# Altium schematic sheet DS33.SchDoc: Плата датчика глубины
size 594 x 420 mm; Author: Стороженко; DrawnBy: Сторож; DocumentNumber: ИПМТ.916197.001 Э3; SheetNumber: 1; SheetTotal: 1; DocumentType1str: Схема; PageSetup: Record=PageOptions|CenterHorizontal=True|CenterVertical=True|PrintScale=0.47|XCorrection=1.00|YCorrection=1.00|PrintKind=1|BorderSize=5000000|LeftOffset=0|BottomOffset=0|Orientation=1|PaperLength=2970|PaperWidth=2100|Scale=100|PaperSource=7|PrintQuality=600|MediaType=0|DitherType=10|PaperKind=A4|PrintScaleMode=1; DocumentName: Кафедра; ModifiedDate: Кафедра; Rule: PcbType=ProtelPcb
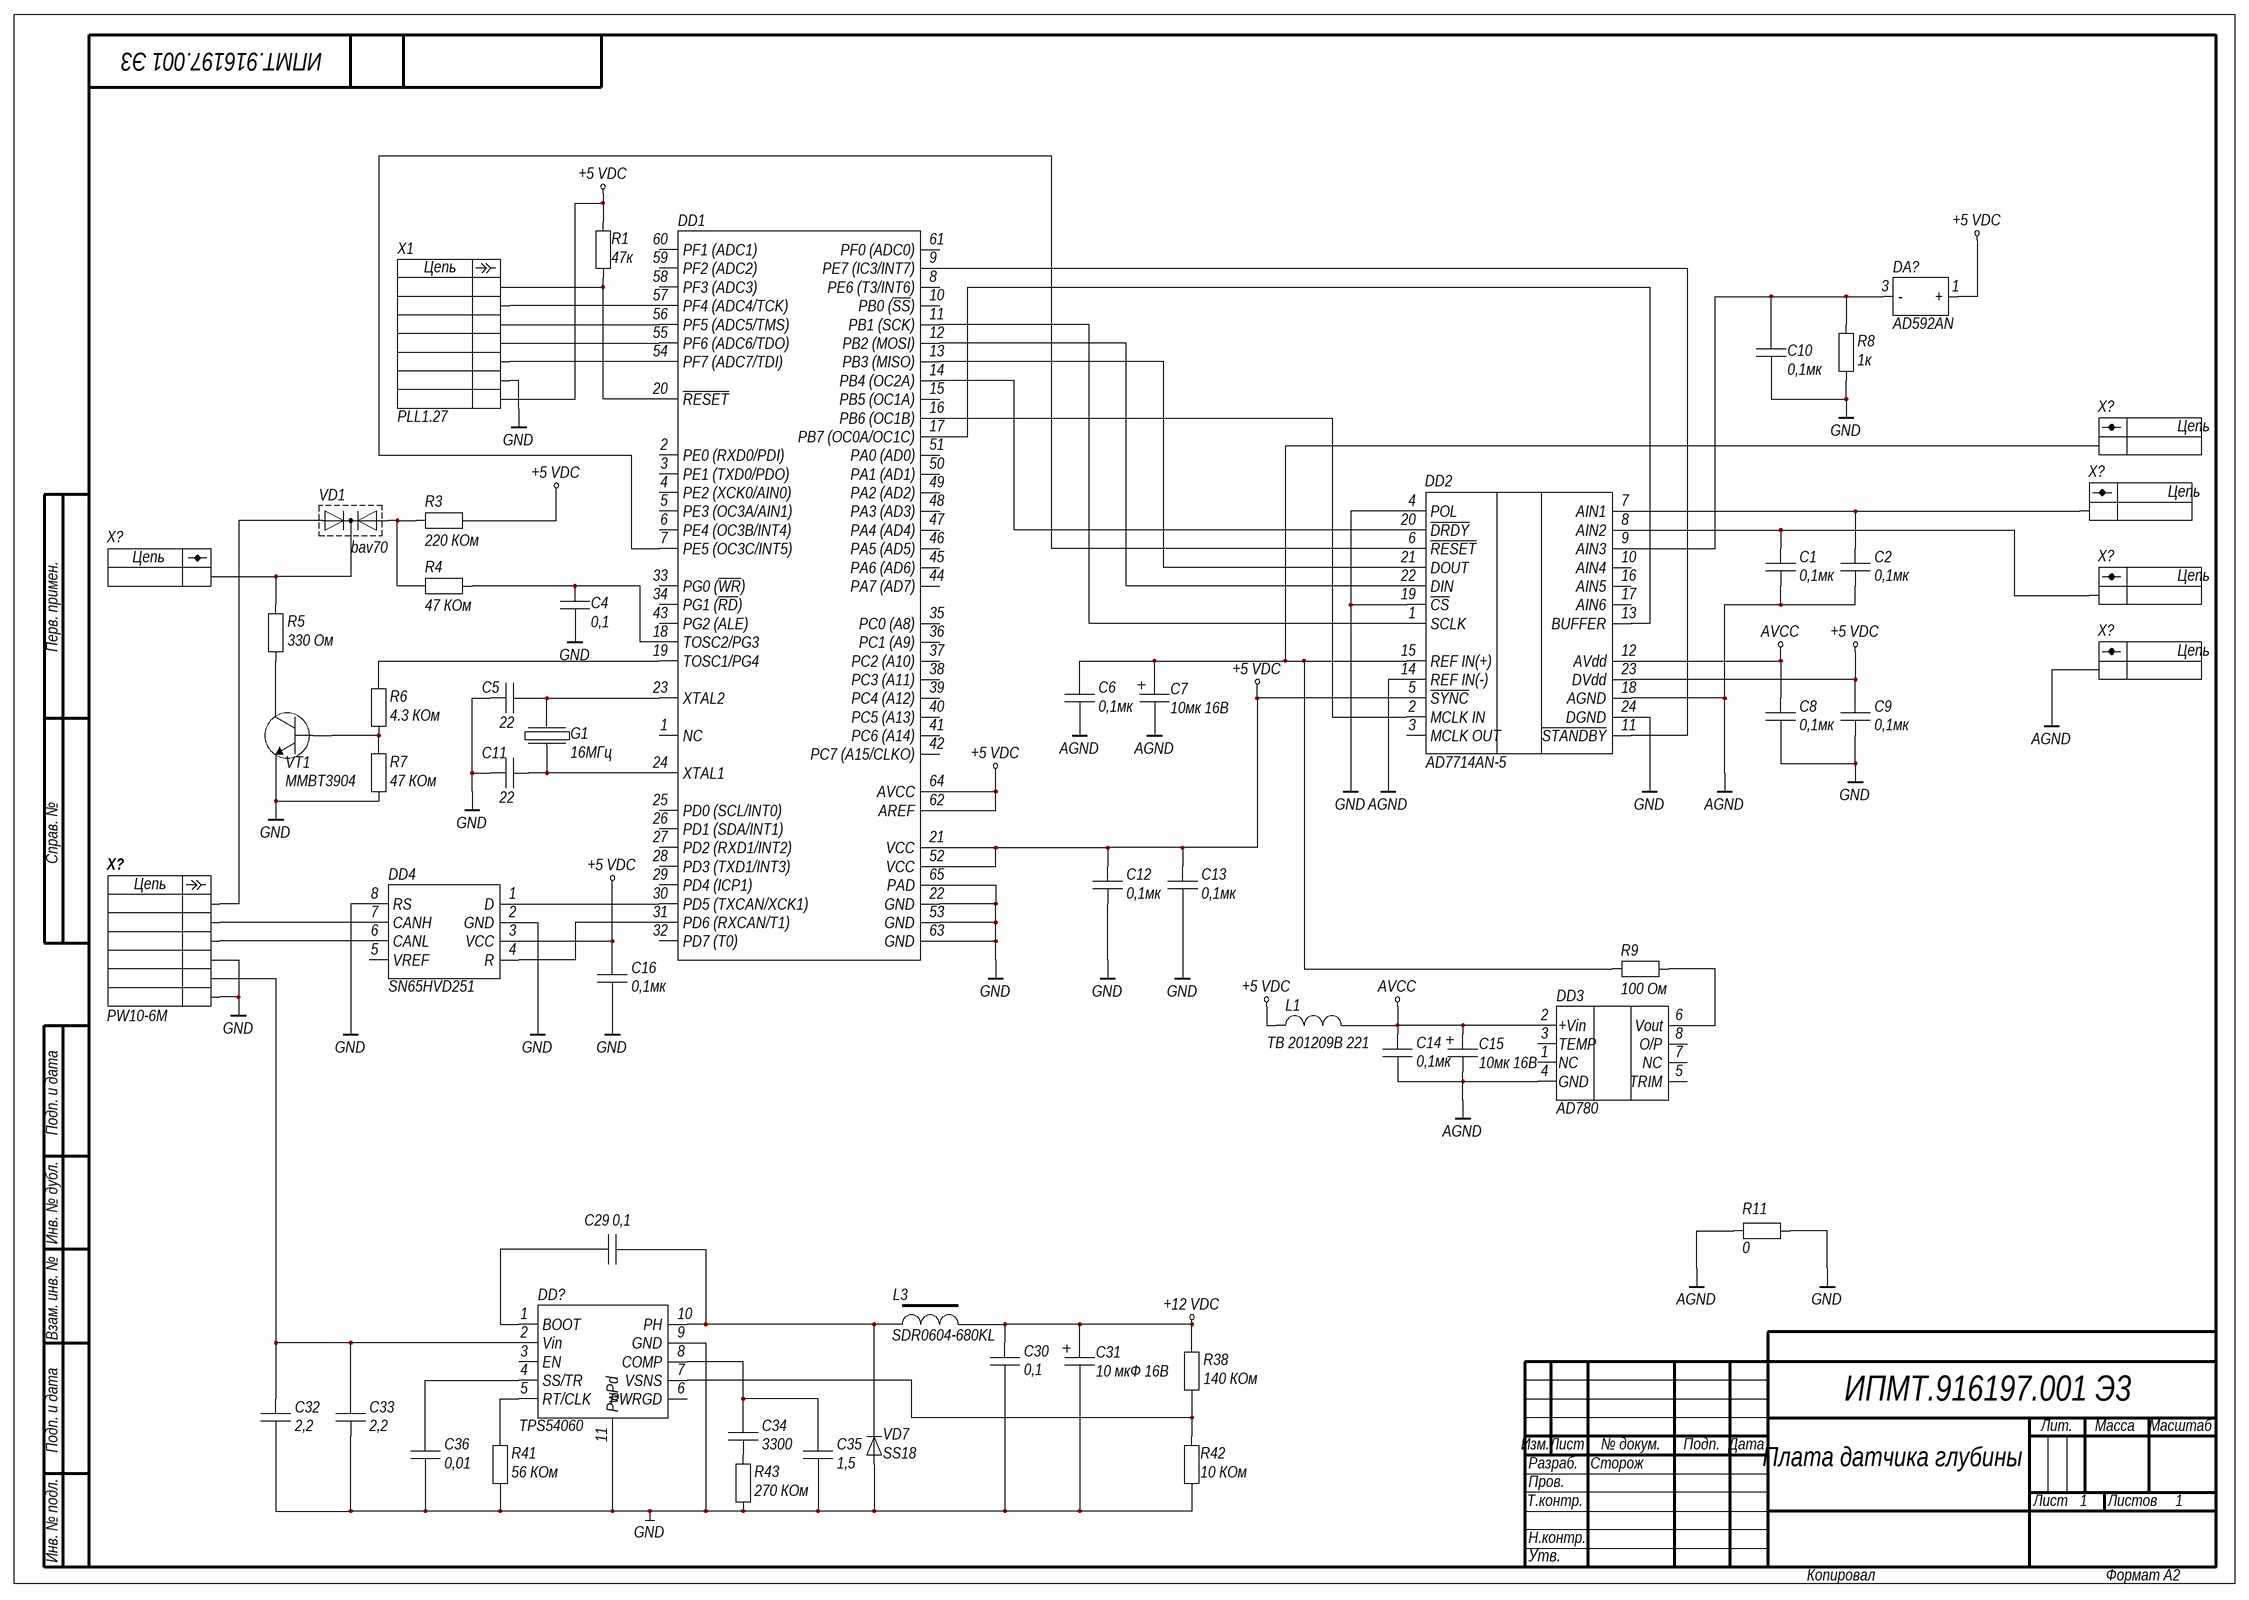
[diagram p0: DS33.SchDoc]

## Parts
(Parts that share a designator on the sheet are numbered #1, #2 ... from top to bottom, then left to right.)
C1  0,1мк  [0402]
C2  0,1мк  [0402]
C4  0,1  [0402]
C5  22  [0402]
C6  0,1мк  [0402]
C7  10мк 16В  [TC3216-1206]
C8  0,1мк  [0402]
C9  0,1мк  [0402]
C10  0,1мк  [0402]
C11  22  [0402]
C12  0,1мк  [0402]
C13  0,1мк  [0402]
C14  0,1мк  [0402]
C15  10мк 16В  [TC3216-1206]
C16  0,1мк  [0402]
C29  0,1  [0402]
C30  0,1  [С0603]
C31  10 мкФ 16В  [TC3216-1206]
C32  2,2  [1206]
C33  2,2  [1206]
C34  3300  [0402]
C35  1,5  [0402]
C36  0,01  [0402]
DA?  AD592AN  [TO-92]
DD1  (no value)  [QFN50P900X900-64V3L]
DD2  AD7714AN-5  [AD7714_TSOP65P640X110-24N]
DD3  AD780  [AD780_SOIC127P600X135-8N]
DD4  SN65HVD251  [SOJ-8]
DD?  TPS54060  [TSSOP50P490_HS-10L]
G1  16МГц  [KX-8]
L1  TB 201209B 221  [L0805]
L3  SDR0604-680KL  [CDRH5D28-100NC]
R1  47к  [0402]
R3  220 КОм  [0402]
R4  47 КОм  [0402]
R5  330 Ом  [0402]
R6  4.3 КОм  [0402]
R7  47 КОм  [0402]
R8  1к  [0402]
R9  100 Ом  [0603]
R11  0  [0402]
R38  140 КОм  [0402]
R41  56 КОм  [0402]
R42  10 КОм  [0402]
R43  270 КОм  [0402]
VD1  bav70  [SOT-23]
VD7  SS18  [SMA]
VT1  MMBT3904  [SOT-23]
X1  PLL1.27  [PLL1.27X7]
X?#1  Контакт  [Контакт d0.7 - duplicate]  (value not drawn)
X?#2  Контакт  [Контакт d0.7 - duplicate]  (value not drawn)
X?#3  Контакт  [Контакт d0.7 - duplicate]  (value not drawn)
X?#4  Контакт  [Контакт d0.7 - duplicate]  (value not drawn)
X?#5  Контакт  [Контакт d0.7 - duplicate]  (value not drawn)
X?#6  PW10-6M  [PLL1.25-6]

## Nets
+5 VDC: C9.1 C12.1 C13.1 C16.1 DA?.1(+) DD1.21(VCC) DD1.52(VCC) DD1.62(AREF) DD1.64(AVCC) DD2.5(~{SYNC}) DD2.23(DVdd) DD4.3(VCC) L1.1 R1.1 R3.2 X1.7
+12 VDC: C30.1 C31.1 L3.2 R38.2
AGND: C1.2 C2.2 C6.2 C7.2 C14.2 C15.2 DD2.14(REF_IN(-)) DD2.18(AGND) DD3.4(GND) R11.2 X?#5.1
AVCC: C8.1 C14.1 C15.1 DD2.12(AVdd) DD3.2(+Vin) L1.2
GND: C4.1 C5.1 C8.2 C9.2 C10.1 C11.1 C12.2 C13.2 C16.2 C30.2 C31.2 C32.2 C33.2 C35.2 C36.2 DD1.22(GND) DD1.53(GND) DD1.63(GND) DD1.65(PAD) DD2.4(POL) DD2.19(~{CS}) DD2.24(DGND) DD4.2(GND) DD4.8(RS) DD?.9(GND) DD?.11(PwPd) R7.1 R8.1 R11.1 R41.1 R42.2 R43.1 VD7.1(Out) VT1.2(S) X1.6 X?#6.4 X?#6.6
NetC1_1: C1.1 DD2.8(AIN2) X?#4.1
NetC2_1: C2.1 DD2.7(AIN1) X?#2.1
NetC4_2: C4.2 DD1.18(TOSC2/PG3) R4.2
NetC5_2: C5.2 DD1.23(XTAL2) G1.2
NetC6_1: C6.1 C7.1 DD2.15(REF_IN(+)) R9.1 X?#1.1
NetC10_2: C10.2 DA?.3(-) DD2.9(AIN3) R8.2
NetC11_2: C11.2 DD1.24(XTAL1) G1.1
NetC29_1: C29.1 DD?.10(PH) L3.1 VD7.2(IN)
NetC29_2: C29.2 DD?.1(BOOT)
NetC32_1: C32.1 C33.1 DD?.2(Vin) X?#6.5
NetC34_1: C34.1 C35.1 DD?.8(COMP)
NetC34_2: C34.2 R43.2
NetC36_1: C36.1 DD?.4(SS/TR)
NetDD1_7: DD1.7(PE5_(OC3C/INT5)) DD2.6(~{RESET})
NetDD1_9: DD1.9(PE7_(IC3/INT7)) DD2.11(~{STANDBY})
NetDD1_11: DD1.11(PB1_(SCK)) DD2.1(SCLK)
NetDD1_12: DD1.12(PB2_(MOSI)) DD2.22(DIN)
NetDD1_13: DD1.13(PB3_(MISO)) DD2.21(DOUT)
NetDD1_14: DD1.14(PB4_(OC2A)) DD2.20(~{DRDY})
NetDD1_16: DD1.16(PB6_(OC1B)) DD2.2(MCLK_IN)
NetDD1_17: DD1.17(PB7_(OC0A/OC1C)) DD2.13(BUFFER)
NetDD1_19: DD1.19(TOSC1/PG4) R6.2
NetDD1_20: DD1.20(~{RESET}) R1.2 X1.1
NetDD1_30: DD1.30(PD5_(TXCAN/XCK1)) DD4.1(D)
NetDD1_31: DD1.31(PD6_(RXCAN/T1)) DD4.4(R)
NetDD1_54: DD1.54(PF7_(ADC7/TDI)) X1.5
NetDD1_55: DD1.55(PF6_(ADC6/TDO)) X1.4
NetDD1_56: DD1.56(PF5_(ADC5/TMS)) X1.3
NetDD1_57: DD1.57(PF4_(ADC4/TCK)) X1.2
NetDD3_6: DD3.6(Vout) R9.2
NetDD4_6: DD4.6(CANL) X?#6.3
NetDD4_7: DD4.7(CANH) X?#6.2
NetDD?_5: DD?.5(RT/CLK) R41.2
NetDD?_7: DD?.7(VSNS) R38.1 R42.1
NetR3_1: R3.1 R4.1 VD1.1
NetR5_1: R5.1 VT1.3(Vbb)
NetR5_2: R5.2 VD1.3 X?#3.1
NetR6_1: R6.1 R7.2 VT1.1(IN)
NetVD1_2: VD1.2 X?#6.1

Not connected (* = marked no-connect by the designer): DA? 2(NC); DD1 1(NC) 2(PE0_(RXD0/PDI)) 3(PE1_(TXD0/PDO)) 4(PE2_(XCK0/AIN0)) 5(PE3_(OC3A/AIN1)) 6(PE4_(OC3B/INT4)) 8(PE6_(T3/INT6)) 10(PB0_(~{SS})) 15(PB5_(OC1A)) 25(PD0_(SCL/INT0)) 26(PD1_(SDA/INT1)) 27(PD2_(RXD1/INT2)) 28(PD3_(TXD1/INT3)) 29(PD4_(ICP1)) 32(PD7_(T0)) 33(PG0_(~{WR})) 34(PG1_(~{RD})) 35(PC0_(A8)) 36(PC1_(A9)) 37(PC2_(A10)) 38(PC3_(A11)) 39(PC4_(A12)) 40(PC5_(A13)) 41(PC6_(A14)) 42(PC7_(A15/CLKO)) 43(PG2_(ALE)) 44(PA7_(AD7)) 45(PA6_(AD6)) 46(PA5_(AD5)) 47(PA4_(AD4)) 48(PA3_(AD3)) 49(PA2_(AD2)) 50(PA1_(AD1)) 51(PA0_(AD0)) 58(PF3_(ADC3)) 59(PF2_(ADC2)) 60(PF1_(ADC1)) 61(PF0_(ADC0)); DD2 3(MCLK_OUT) 10(AIN4) 16(AIN5) 17(AIN6); DD3 1(NC) 3(TEMP) 5(TRIM) 7(NC) 8(O/P); DD4 5(VREF); DD? 3(EN) 6(PWRGD)

## Notes on the sheet
- Перв. примен.
- Справ. №
- Подп. и дата
- Инв. № дубл.
- Взам. инв. №
- Изм.
- Лист
- № докум.
- Подп.
- Дата
- Лит.
- Масса
- Масштаб
- Т.контр.
- Пров.
- Разраб.
- Листов
- Инв. № подл.
- Н.контр.
- Утв.
- Копировал
- Формат А2
- (in symbol PLL1.27-7) Цепь
- (in symbol PW10-6M) Цепь
- (in symbol Контакт_2) Цепь

## Library data of the parts
C1 C2 C6 C8 C9 C13 C14 C16 = Кондесатор керамический 0805 Версия 1: CERCAP 0805; OutComment: CERCAP 0603  X7R 0,1 мкФ 50В; LatestRevisionDate: 25.03.2010; Name: 0,1мк; PackageDescription: 0603; Publisher: IMTP FEB RAS
C4 = Кондесатор керамический 0805 Версия 1: CERCAP 0805; OutComment: CERCAP 0805  X7R 0,01 мкФ 50В; LatestRevisionDate: 25.03.2010; Name: 0,1; PackageDescription: 0805; Publisher: IMTP FEB RAS
C5 C11 = Кондесатор керамический 0805 Версия 1: CERCAP 0805; OutComment: CERCAP 0603 NPO 22 пкФ 16В; LatestRevisionDate: 25.03.2010; Name: 22; PackageDescription: 0603; Publisher: IMTP FEB RAS
C7 C15 = Кондесатор танталовый Тип А Версия 1_1: TCAP A; OutComment: TCAP A  10 мкФ 16В; LatestRevisionDate: 25.03.2010; Name: 10мк 16В; PackageDescription: A; Publisher: IMTP FEB RAS
C10 = Кондесатор керамический 0805 Версия 1: CERCAP 0805; OutComment: CERCAP 0603 NPO 0.1 мкФ 16В; LatestRevisionDate: 25.03.2010; Name: 0,1мк; PackageDescription: 0603; Publisher: IMTP FEB RAS
C12 = Кондесатор керамический 0805 Версия 1: CERCAP 0805; OutComment: CERCAP 0402  X7R 0,1 мкФ 50В; LatestRevisionDate: 25.03.2010; Name: 0,1мк; PackageDescription: 0402; Publisher: IMTP FEB RAS
C29 = Кондесатор керамический 0805 Версия 1: CERCAP 0805; Name: 0,1мк; OutComment: CERCAP 0402  X7R 0,1 мкФ 16В; LatestRevisionDate: 25.03.2010; PackageDescription: 0402; Publisher: IMTP FEB RAS
C30 = Кондесатор керамический 0805 Версия 1: CERCAP 0805; Name: 0,1мк; OutComment: CERCAP 0603  X7R 0,1 мкФ 50В; LatestRevisionDate: 25.03.2010; PackageDescription: 0603; Publisher: IMTP FEB RAS
C31 = Кондесатор танталовый Тип А Версия 1_1: TCAP A; Name: 10мк 16В; OutComment: TCAP A  10 мкФ 16В; LatestRevisionDate: 25.03.2010; PackageDescription: A; Publisher: IMTP FEB RAS
C32 C33 = Кондесатор керамический 0805 Версия 1: CERCAP 0805; Name: 2,2мк; OutComment: CERCAP 1206  X7R 2,2 мкФ 50В; LatestRevisionDate: 25.03.2010; PackageDescription: 1206; Publisher: IMTP FEB RAS
C34 = Кондесатор керамический 0805 Версия 1: CERCAP 0805; OutComment: CERCAP 0402  X7R 3300 пкФ 16В; LatestRevisionDate: 25.03.2010; Name: 3300; PackageDescription: 0402; Publisher: IMTP FEB RAS
C35 = Кондесатор керамический 0805 Версия 1: CERCAP 0805; OutComment: CERCAP 0402  X7R 1,5 пкФ 16В; LatestRevisionDate: 25.03.2010; Name: 1,5; PackageDescription: 0402; Publisher: IMTP FEB RAS
C36 = Кондесатор керамический 0805 Версия 1: CERCAP 0805; Name: 0,01мк; OutComment: CERCAP 0402  X7R 0,01 мкФ 16В; LatestRevisionDate: 25.03.2010; PackageDescription: 0402; Publisher: IMTP FEB RAS
DA? = AD592: Датчик температуры; LastRevisionDate: 25.03.2010; Name: AD592AN; OutComment: AD592AN; PackageDescription: TO-92; Publisher: IMTP FEB RAS
DD1 = AT90CAN128-16MI: 8-Bit AVR Microcontroller; OutComment: AT90CAN128-16AI; LatestRevisionDate: 2015-11-29; Name: AT90CAN128; PackageDescription: 64 Leads Quad Flat No Lead; Publisher: std
DD2 = AD7714: Name: AD7714AN-5; OutComment: AD7714AN-5
DD3 = AD780: High Precision Reference; Published: 05-06-2014; PackageVersion: JUN-2014; Publisher: IMTP; PackageDescription: PDIP-8, SOIC-8; ComponentLink1Description: Manufacturer Link; Name: AD780; OutComment: AD780
DD4 = SN65HDV251DR: OutComment: SN65HVD251DR; LastRevisionDate: 25.03.2010; Name: SN65HVD251; PackageDescription: SOIC 8; Publisher: IMTP FEB RAS
G1 = GEYER HC49-S: Кварцевый резонатор Geyer; OutComment: GEYER KX-8 16 МГц; LatestRevisionDate: 25.03.2010; Name: 16МГц; PackageDescription: KX-8; Publisher: IMTP FEB RAS
L1 = TB 201209B 221: Индуктивный фильтр; LatestRevisionDate: 25.03.2010; Name: TB 201209B 221; OutComment: TB 201209B 221; PackageDescription: 0805; Publisher: IMTP FEB RAS
L3 = CDRH5D28-100NC: Индуктивный фильтр; LatestRevisionDate: 25.03.2010; Name: SDR0604-680KL; OutComment: SDR0604-680KL; PackageDescription: SMD; Publisher: IMTP FEB RAS
R1 R4 R7 = Резистор 0805 5% Версия 1: RES 0805 0.125 W 5%; OutComment: 0402 47 КОм 5%; LatestRevisionDate: 25.03.2010; Publisher: IMTP FEB RAS
  R1: Name: 47к; PackageDescription: 0402
  R4 R7: Name: 47 КОм; PackageDescription: 0805
R3 = Резистор 0805 5% Версия 1: RES 0805 0.125 W 5%; OutComment: 0805 220 КОм 5%; LatestRevisionDate: 25.03.2010; Name: 220 КОм; PackageDescription: 0805; Publisher: IMTP FEB RAS
R5 = Резистор 0805 5% Версия 1: RES 0805 0.125 W 5%; OutComment: 0402 330 Ом 5%; LatestRevisionDate: 25.03.2010; Name: 330 Ом; PackageDescription: 0805; Publisher: IMTP FEB RAS
R6 = Резистор 0805 5% Версия 1: RES 0805 0.125 W 5%; OutComment: 0805 4.3 КОм 5%; LatestRevisionDate: 25.03.2010; Name: 4.3 КОм; PackageDescription: 0805; Publisher: IMTP FEB RAS
R8 = Резистор 0805 5% Версия 1: RES 0805 0.125 W 5%; OutComment: 0603 1 КОм 1%; LatestRevisionDate: 25.03.2010; Name: 1к; PackageDescription: 0603; Publisher: IMTP FEB RAS
R9 = Резистор 0805 5% Версия 1: RES 0805 0.125 W 5%; OutComment: 0805 470 Ом 5%; LatestRevisionDate: 25.03.2010; Name: 100 Ом; PackageDescription: 0805; Publisher: IMTP FEB RAS
R11 = Резистор 0805 5% Версия 1: RES 0805 0.125 W 5%; OutComment: 0402 0 КОм 1%; LatestRevisionDate: 25.03.2010; Name: 0; PackageDescription: 0603; Publisher: IMTP FEB RAS
R38 = Резистор 0805 5% Версия 1: RES 0805 0.125 W 5%; Name: 140к; OutComment: 0402 140 КОм 5%; LatestRevisionDate: 25.03.2010; PackageDescription: 0402; Publisher: IMTP FEB RAS
R41 = Резистор 0805 5% Версия 1: RES 0805 0.125 W 5%; Name: 56к; OutComment: 0402 56 КОм 5%; LatestRevisionDate: 25.03.2010; PackageDescription: 0402; Publisher: IMTP FEB RAS
R42 = Резистор 0805 5% Версия 1: RES 0805 0.125 W 5%; Name: 10к; OutComment: 0402 10 КОм 5%; LatestRevisionDate: 25.03.2010; PackageDescription: 0402; Publisher: IMTP FEB RAS
R43 = Резистор 0805 5% Версия 1: RES 0805 0.125 W 5%; Name: 270к; OutComment: 0402 270 КОм 5%; LatestRevisionDate: 25.03.2010; PackageDescription: 0402; Publisher: IMTP FEB RAS
VD1 = bav70: DIODE; LastRevisionDate: 11.06.2010; Name: bav70; OutComment: bav70; PackageDescription: SOT-23; Publisher: IMTP FEB RAS
VD7 = SS18: DIODE; LastRevisionDate: 11.06.2010; Name: SS18; OutComment: SS18; PackageDescription: SMA; Publisher: IMTP FEB RAS
VT1 = MMBT3904: Транзистор; LastRevisionDate: 11.06.2010; Name: MMBT3904; OutComment: MMBT3904; PackageDescription: SOT-23; Publisher: IMTP FEB RAS
X1 = PLL1.27-7: OutComment: PLL1.27; Name: PLL1.27; LatestRevisionDate: 22.03.2010; PackageDescription: *; Publisher: IMTP FEB RAS
X?#1-X?#5 = Контакт_2: OutComment: Контакт; Name: Контакт; LatestRevisionDate: 22.03.2010; PackageDescription: *; Publisher: IMTP FEB RAS
DD? = TPS54060: LastRevisionDate: 25.03.2010; Name: TPS54060; OutComment: TPS54060; PackageDescription: TSSOP; Publisher: IMTP FEB RAS
X?#6 = PW10-6M: OutComment: PW10-6M; Name: PW10-6M; LatestRevisionDate: 22.03.2010; PackageDescription: *; Publisher: IMTP FEB RAS